# EAGLE design TwoMegCoCo_RAM (EAGLE 7.7.0)
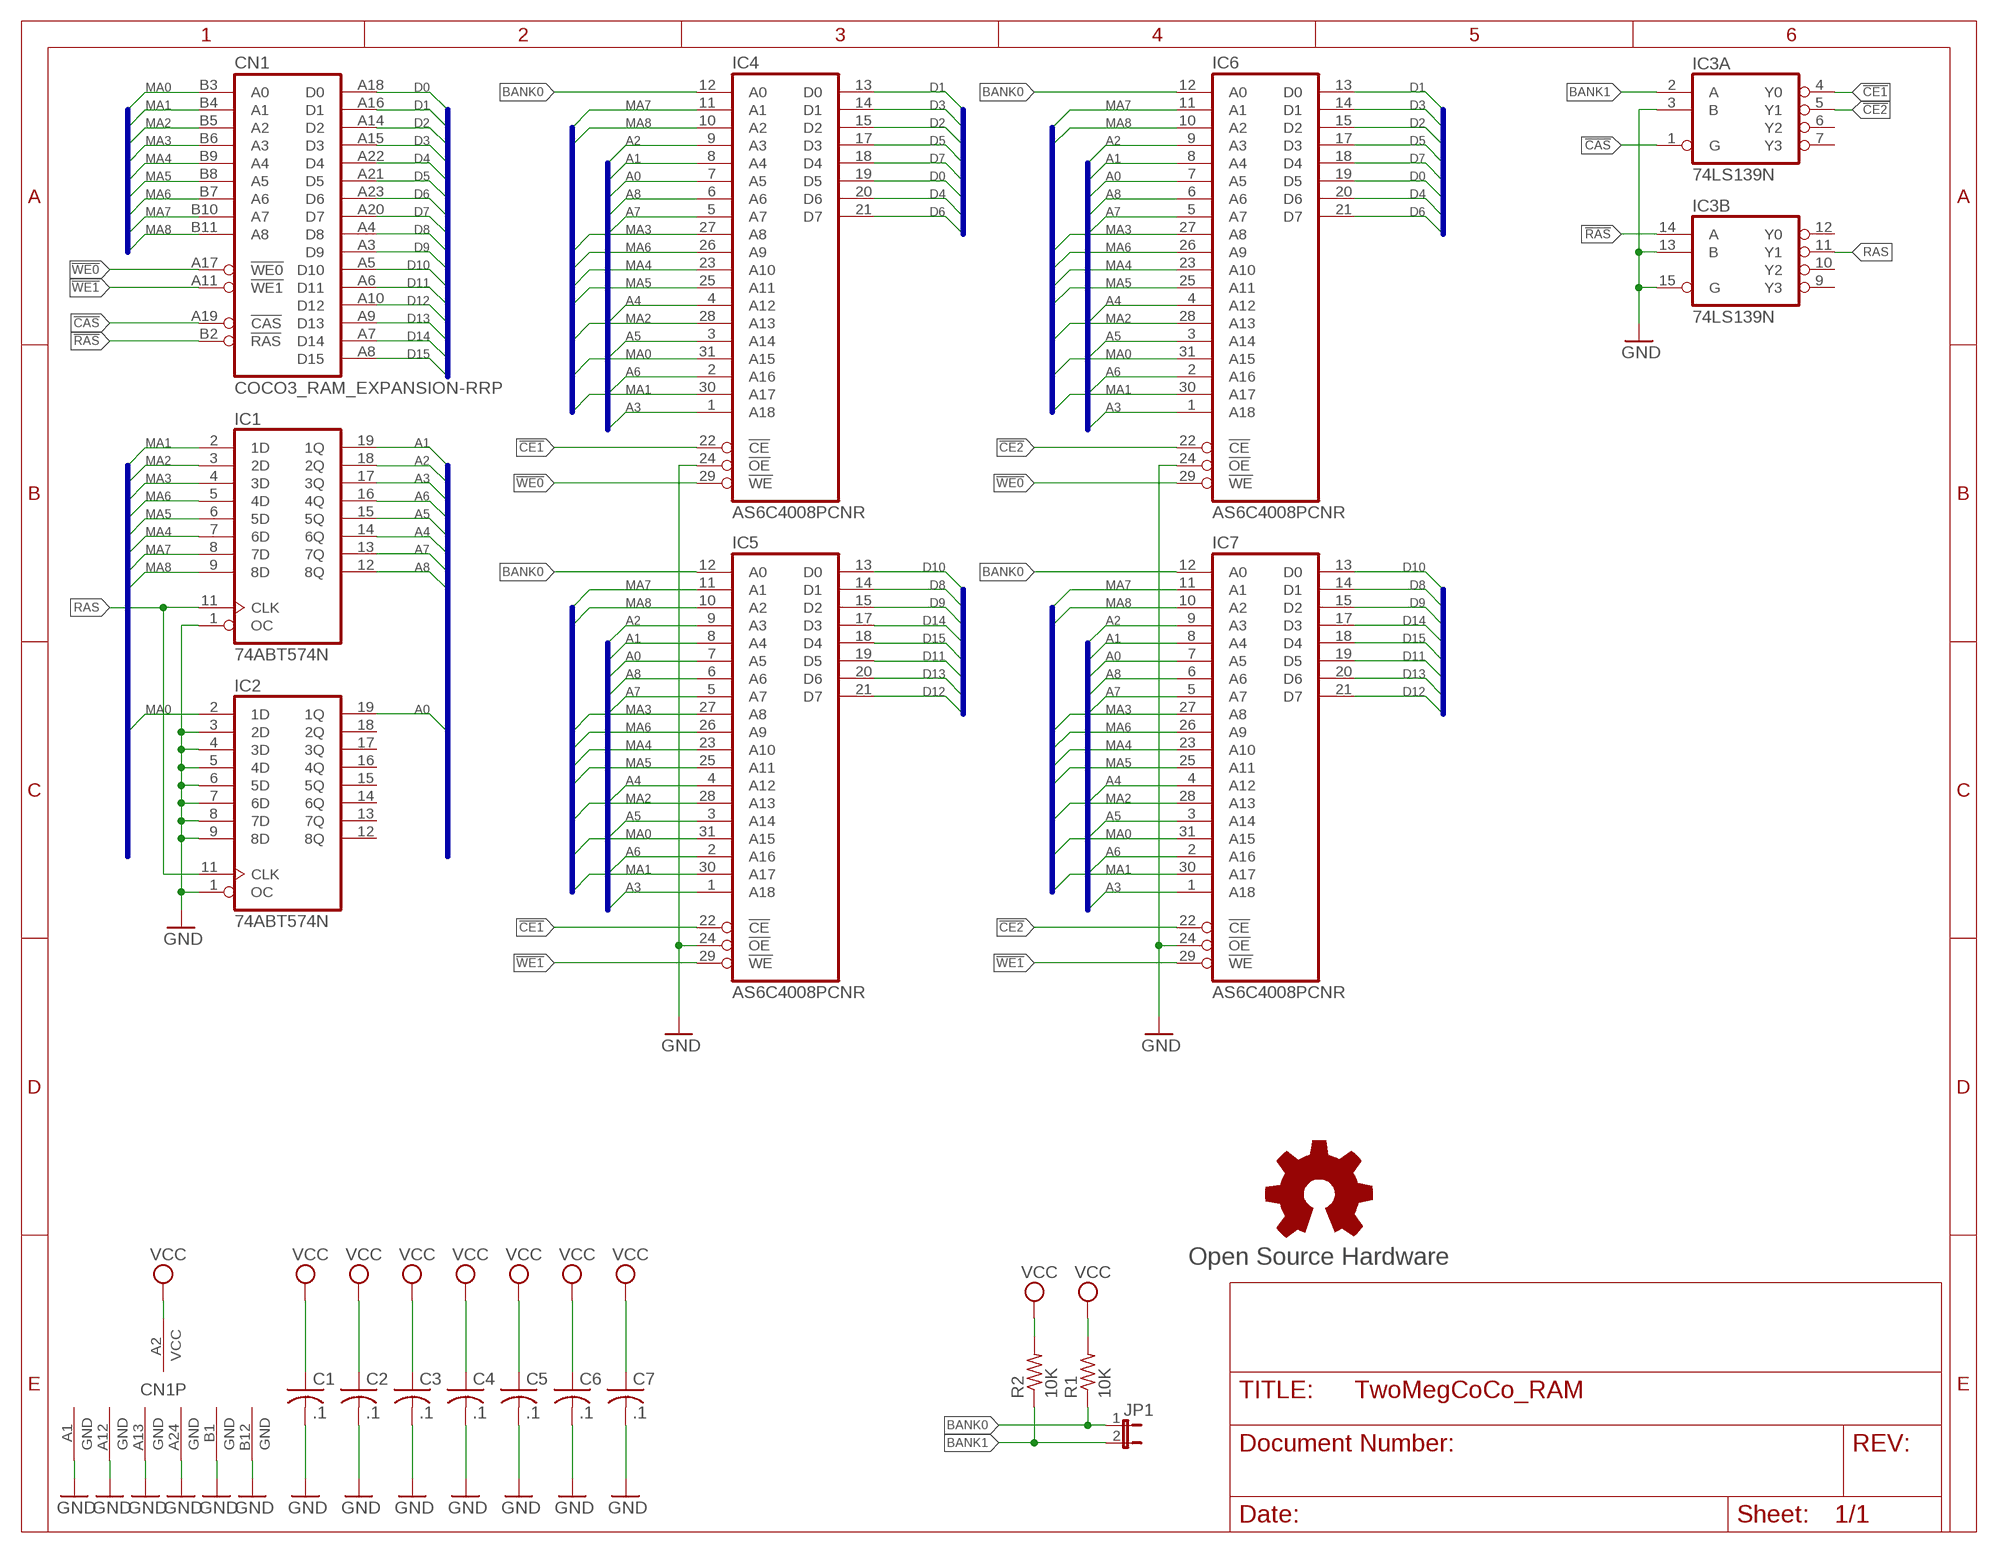
[diagram p0: schematic, sheet 1]

## Parts
C1  .1  C-US025-025X050  [C025-025X050]
C2  .1  C-US025-025X050  [C025-025X050]
C3  .1  C-US025-025X050  [C025-025X050]
C4  .1  C-US025-025X050  [C025-025X050]
C5  .1  C-US025-025X050  [C025-025X050]
C6  .1  C-US025-025X050  [C025-025X050]
C7  .1  C-US025-025X050  [C025-025X050]
CN1  COCO3_RAM_EXPANSION-RRP  [RAM_EXPANSION_REV_RP]
GOLD_ORB_SM1  Open Source Hardware  OSHWLOGOLOGO8MM  [OSHW_8MM]
IC1  74ABT574N  74HC574N  [DIL20-RP]
IC2  74ABT574N  74HC574N  [DIL20-RP]
IC3  74LS139N  [DIL16-RP]
IC4  AS6C4008PCNR  [DIL32-RP]
IC5  AS6C4008PCNR  [DIL32-RP]
IC6  AS6C4008PCNR  [DIL32-RP]
IC7  AS6C4008PCNR  [DIL32-RP]
JP1  JP1E  [JP1]
R1  10K  R-US_0204/7  [0204/7]
R2  10K  R-US_0204/7  [0204/7]

## Nets
!CAS: CN1.A19(!CAS) IC3.1(A:G)
!CE1: IC3.4(A:Y0) IC4.22(!CE) IC5.22(!CE)
!CE2: IC3.5(A:Y1) IC6.22(!CE) IC7.22(!CE)
!RAS: CN1.B2(!RAS) IC3.14(B:A)
!WE0: CN1.A17(!WE0) IC4.29(!WE) IC6.29(!WE)
!WE1: CN1.A11(!WE1) IC5.29(!WE) IC7.29(!WE)
A0: IC2.19(1Q) IC4.7(A5) IC5.7(A5) IC6.7(A5) IC7.7(A5)
A1: IC1.19(1Q) IC4.8(A4) IC5.8(A4) IC6.8(A4) IC7.8(A4)
A2: IC1.18(2Q) IC4.9(A3) IC5.9(A3) IC6.9(A3) IC7.9(A3)
A3: IC1.17(3Q) IC4.1(A18) IC5.1(A18) IC6.1(A18) IC7.1(A18)
A4: IC1.14(6Q) IC4.4(A12) IC5.4(A12) IC6.4(A12) IC7.4(A12)
A5: IC1.15(5Q) IC4.3(A14) IC5.3(A14) IC6.3(A14) IC7.3(A14)
A6: IC1.16(4Q) IC4.2(A16) IC5.2(A16) IC6.2(A16) IC7.2(A16)
A7: IC1.13(7Q) IC4.5(A7) IC5.5(A7) IC6.5(A7) IC7.5(A7)
A8: IC1.12(8Q) IC4.6(A6) IC5.6(A6) IC6.6(A6) IC7.6(A6)
BANK0: IC4.12(A0) IC5.12(A0) IC6.12(A0) IC7.12(A0) JP1.1 R1.1
BANK1: IC3.2(A:A) JP1.2 R2.1
D0: CN1.A18(D0) IC4.19(D5) IC6.19(D5)
D1: CN1.A16(D1) IC4.13(D0) IC6.13(D0)
D2: CN1.A14(D2) IC4.15(D2) IC6.15(D2)
D3: CN1.A15(D3) IC4.14(D1) IC6.14(D1)
D4: CN1.A22(D4) IC4.20(D6) IC6.20(D6)
D5: CN1.A21(D5) IC4.17(D3) IC6.17(D3)
D6: CN1.A23(D6) IC4.21(D7) IC6.21(D7)
D7: CN1.A20(D7) IC4.18(D4) IC6.18(D4)
D8: CN1.A4(D8) IC5.14(D1) IC7.14(D1)
D9: CN1.A3(D9) IC5.15(D2) IC7.15(D2)
D10: CN1.A5(D10) IC5.13(D0) IC7.13(D0)
D11: CN1.A6(D11) IC5.19(D5) IC7.19(D5)
D12: CN1.A10(D12) IC5.21(D7) IC7.21(D7)
D13: CN1.A9(D13) IC5.20(D6) IC7.20(D6)
D14: CN1.A7(D14) IC5.17(D3) IC7.17(D3)
D15: CN1.A8(D15) IC5.18(D4) IC7.18(D4)
GND: C1.2 C2.2 C3.2 C4.2 C5.2 C6.2 C7.2 CN1.A1(GND) CN1.A12(GND) CN1.A13(GND) CN1.A24(GND) CN1.B1(GND) CN1.B12(GND) IC1.1(OC) IC2.1(OC) IC2.3(2D) IC2.4(3D) IC2.5(4D) IC2.6(5D) IC2.7(6D) IC2.8(7D) IC2.9(8D) IC3.3(A:B) IC3.13(B:B) IC3.15(B:G) IC4.24(!OE) IC5.24(!OE) IC6.24(!OE) IC7.24(!OE)
MA0: CN1.B3(A0) IC2.2(1D) IC4.31(A15) IC5.31(A15) IC6.31(A15) IC7.31(A15)
MA1: CN1.B4(A1) IC1.2(1D) IC4.30(A17) IC5.30(A17) IC6.30(A17) IC7.30(A17)
MA2: CN1.B5(A2) IC1.3(2D) IC4.28(A13) IC5.28(A13) IC6.28(A13) IC7.28(A13)
MA3: CN1.B6(A3) IC1.4(3D) IC4.27(A8) IC5.27(A8) IC6.27(A8) IC7.27(A8)
MA4: CN1.B9(A4) IC1.7(6D) IC4.23(A10) IC5.23(A10) IC6.23(A10) IC7.23(A10)
MA5: CN1.B8(A5) IC1.6(5D) IC4.25(A11) IC5.25(A11) IC6.25(A11) IC7.25(A11)
MA6: CN1.B7(A6) IC1.5(4D) IC4.26(A9) IC5.26(A9) IC6.26(A9) IC7.26(A9)
MA7: CN1.B10(A7) IC1.8(7D) IC4.11(A1) IC5.11(A1) IC6.11(A1) IC7.11(A1)
MA8: CN1.B11(A8) IC1.9(8D) IC4.10(A2) IC5.10(A2) IC6.10(A2) IC7.10(A2)
RAS: IC1.11(CLK) IC2.11(CLK) IC3.11(B:Y1)
VCC: C1.1 C2.1 C3.1 C4.1 C5.1 C6.1 C7.1 CN1.A2(VCC) R1.2 R2.2
Unconnected: IC2.12(8Q) IC2.13(7Q) IC2.14(6Q) IC2.15(5Q) IC2.16(4Q) IC2.17(3Q) IC2.18(2Q) IC3.6(A:Y2) IC3.7(A:Y3) IC3.9(B:Y3) IC3.10(B:Y2) IC3.12(B:Y0)

## Buses
D[0..15]
MA[0..8]
A[0..8]

## Power pins joined to a net without a drawn wire
GND: IC1.10(GND) IC2.10(GND) IC3.8(P:GND) IC4.16(GND) IC5.16(GND) IC6.16(GND) IC7.16(GND)
VCC: IC1.20(VCC) IC2.20(VCC) IC3.16(P:VCC) IC4.32(VCC) IC5.32(VCC) IC6.32(VCC) IC7.32(VCC)

## Library data of the parts
C1-C7 = rcl:C-US: CAPACITOR, American symbol
CN1 = coco:COCO3_RAM_EXPANSION
GOLD_ORB_SM1 = oshw:OSHWLOGO: The OSHW logo for PCB layout
IC1 IC2 = 74xx-us-jlb:74*574: 8-bit D type FLIP FLOP bus driver
IC3 = 74xx-us-jlb:74*139: Dual 2-line to 4-line DECODER/DEMULTIPLEXER
IC4-IC7 = memory-alliance:AS6C4008
JP1 = jumper-jlb:JP1E: JUMPER
R1 R2 = resistor:R-US_: RESISTOR, American symbol

## Board
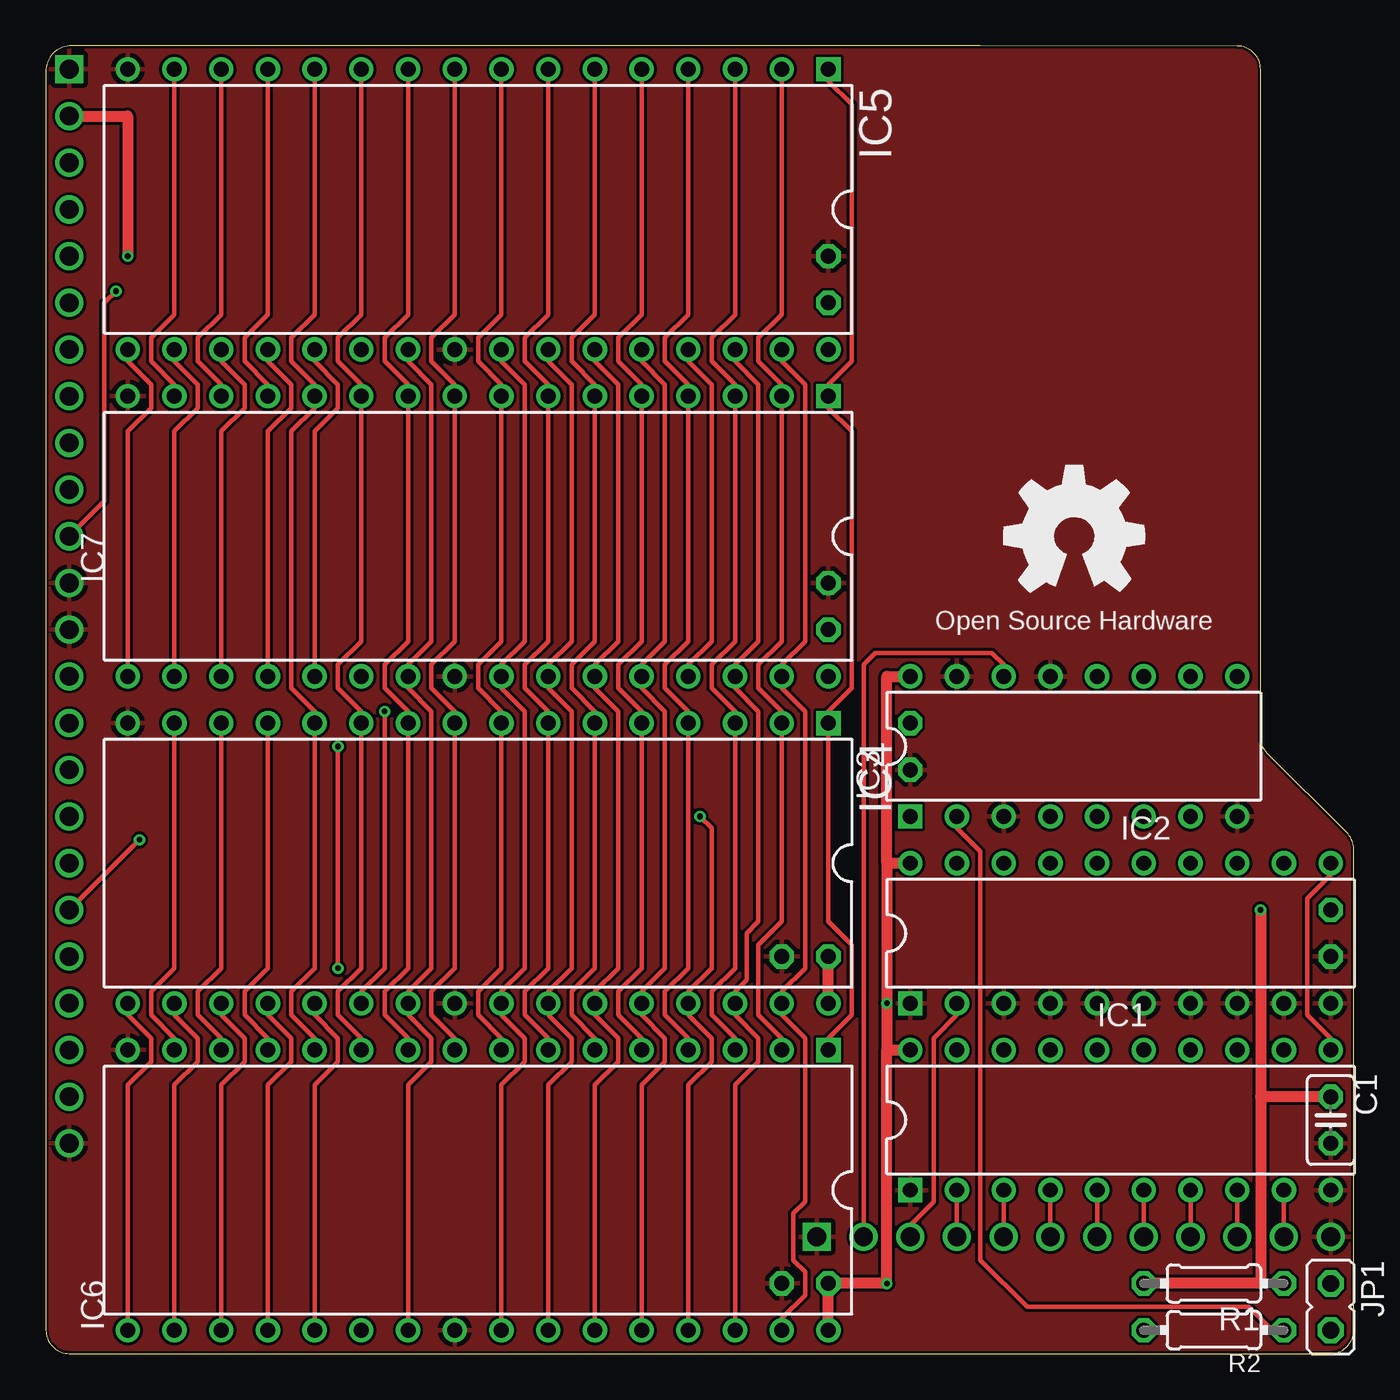
[diagram p1: board, top side]
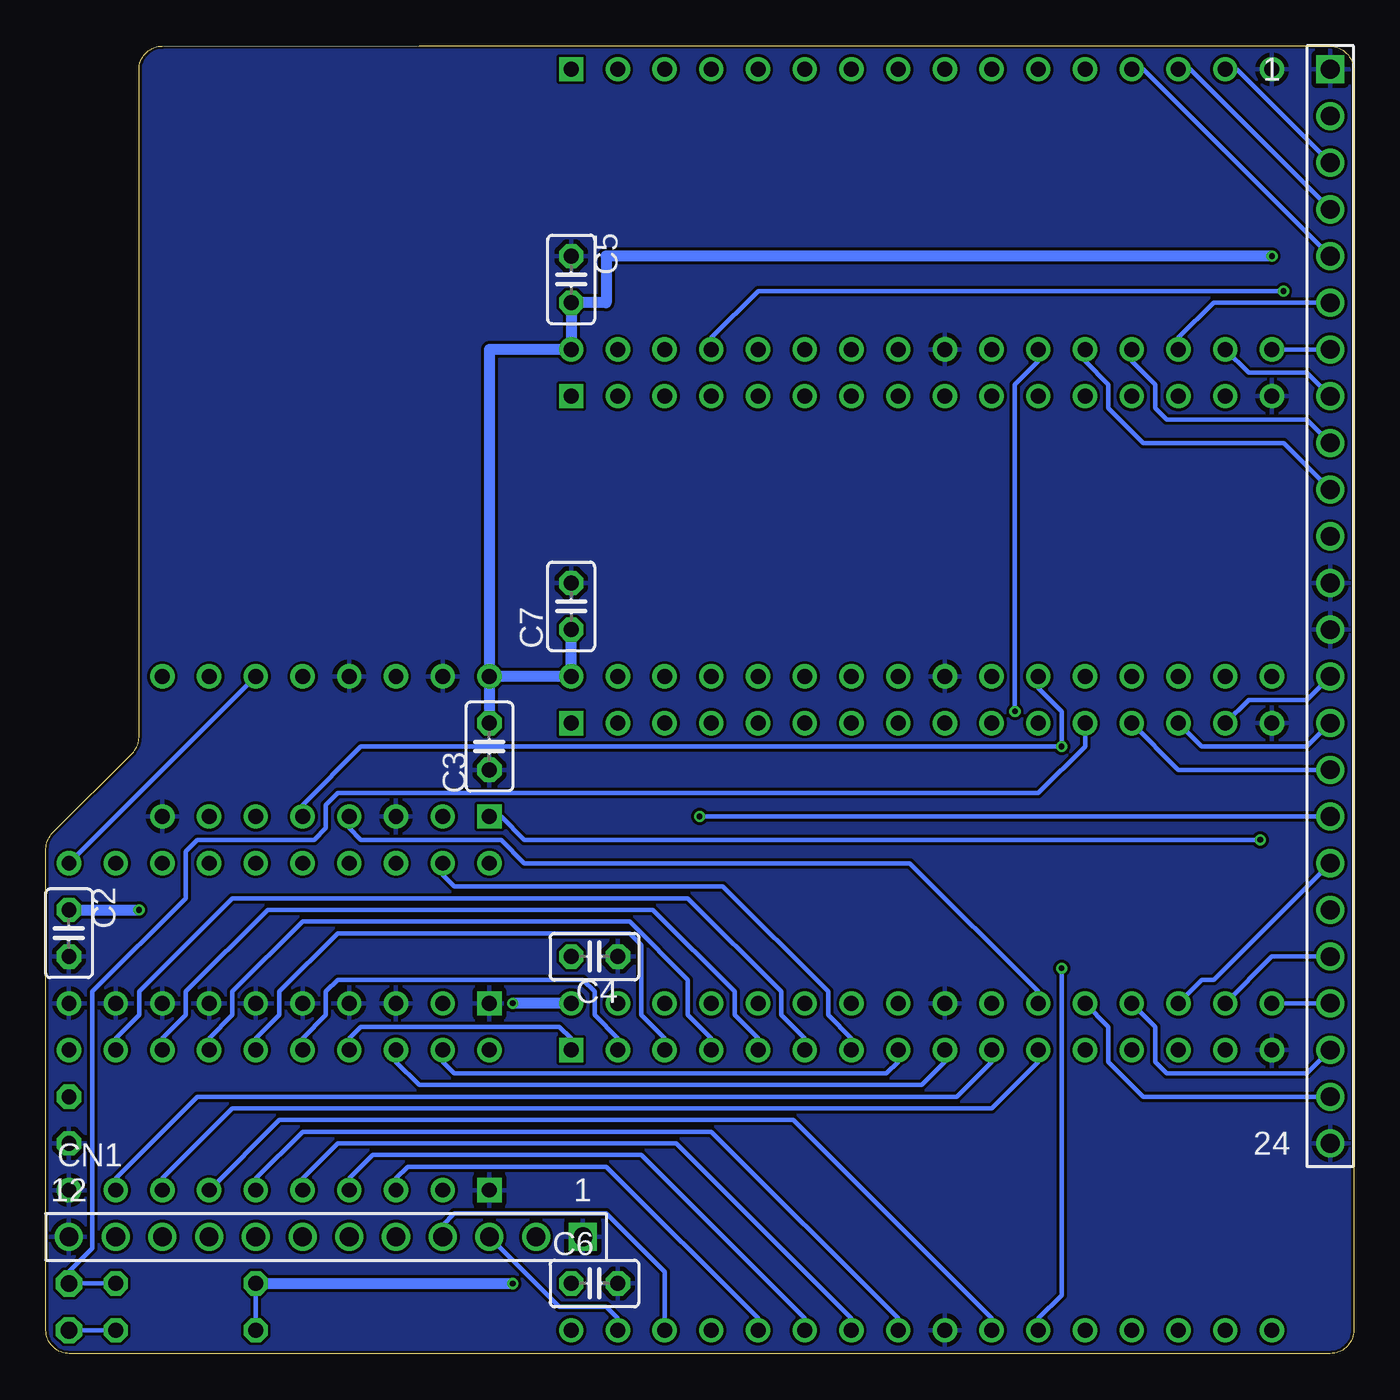
[diagram p2: board, bottom side, seen from below]

Size 71.1 x 71.12 mm. Coordinates in mm from the lower left corner, seen from the top.
Outline: 64.77,71.12 50.79,71.12 1.27,71.12 arc85 0,69.85 0,1.27 arc90 1.27,0 69.83,0 arc90 71.1,1.27 71.1,27.43 arc45 70.73,28.33 66.41,32.65 arc-49 66.04,33.64 66.04,69.84 arc90 64.77,71.12
Copper layers (1*16): Top 0.035mm / dielectric 1.5mm / Bottom 0.035mm
Design rules "hackvana *": minimum track width 6mil, minimum drill 0.3mm, track to track 6mil, track to pad 6mil, pad to pad 6mil, via to via 6mil, smd to smd 0mil, copper to edge 6mil, drill to drill 6mil, minimum pad ring 10mil, minimum via ring 6mil, stop-mask expansion 2mil, vias tented up to drill 100mil, thermal gap 10mil

### Footprints (pad centres in the part's own frame; a part is rotated, then mirrored left to right if it is on the bottom)
C025-025X050 = drill 0.813 octagon: 1 -1.27,0; 2 1.27,0
RAM_EXPANSION_REV_RP = drill 1.016 square: A1 -34.29,31.75; B1 6.35,-31.75 | drill 1.016: A2 -34.29,29.21; A3 -34.29,26.67; A4 -34.29,24.13; A5 -34.29,21.59; A6 -34.29,19.05; A7 -34.29,16.51; A8 -34.29,13.97; A9 -34.29,11.43; A10 -34.29,8.89; A11 -34.29,6.35; A12 -34.29,3.81; A13 -34.29,1.27; A14 -34.29,-1.27; A15 -34.29,-3.81; A16 -34.29,-6.35; A17 -34.29,-8.89; A18 -34.29,-11.43; A19 -34.29,-13.97; A20 -34.29,-16.51; A21 -34.29,-19.05; A22 -34.29,-21.59; A23 -34.29,-24.13; A24 -34.29,-26.67; B2 8.89,-31.75; B3 11.43,-31.75; B4 13.97,-31.75; B5 16.51,-31.75; B6 19.05,-31.75; B7 21.59,-31.75; B8 24.13,-31.75; B9 26.67,-31.75; B10 29.21,-31.75; B11 31.75,-31.75; B12 34.29,-31.75
DIL20-RP = drill 0.813 square: 1 -11.43,-3.81 | drill 0.813: 2 -8.89,-3.81; 3 -6.35,-3.81; 4 -3.81,-3.81; 5 -1.27,-3.81; 6 1.27,-3.81; 7 3.81,-3.81; 8 6.35,-3.81; 9 8.89,-3.81; 10 11.43,-3.81; 11 11.43,3.81; 12 8.89,3.81; 13 6.35,3.81; 14 3.81,3.81; 15 1.27,3.81; 16 -1.27,3.81; 17 -3.81,3.81; 18 -6.35,3.81; 19 -8.89,3.81; 20 -11.43,3.81
DIL16-RP = drill 0.813 square: 1 -8.89,-3.81 | drill 0.813: 2 -6.35,-3.81; 3 -3.81,-3.81; 4 -1.27,-3.81; 5 1.27,-3.81; 6 3.81,-3.81; 7 6.35,-3.81; 8 8.89,-3.81; 9 8.89,3.81; 10 6.35,3.81; 11 3.81,3.81; 12 1.27,3.81; 13 -1.27,3.81; 14 -3.81,3.81; 15 -6.35,3.81; 16 -8.89,3.81
DIL32-RP = drill 0.813 square: 1 -19.05,-7.62 | drill 0.813: 2 -16.51,-7.62; 3 -13.97,-7.62; 4 -11.43,-7.62; 5 -8.89,-7.62; 6 -6.35,-7.62; 7 -3.81,-7.62; 8 -1.27,-7.62; 9 1.27,-7.62; 10 3.81,-7.62; 11 6.35,-7.62; 12 8.89,-7.62; 13 11.43,-7.62; 14 13.97,-7.62; 15 16.51,-7.62; 16 19.05,-7.62; 17 19.05,7.62; 18 16.51,7.62; 19 13.97,7.62; 20 11.43,7.62; 21 8.89,7.62; 22 6.35,7.62; 23 3.81,7.62; 24 1.27,7.62; 25 -1.27,7.62; 26 -3.81,7.62; 27 -6.35,7.62; 28 -8.89,7.62; 29 -11.43,7.62; 30 -13.97,7.62; 31 -16.51,7.62; 32 -19.05,7.62
JP1 = drill 0.914 octagon: 1 0,-1.27; 2 0,1.27
0204/7 = drill 0.813 octagon: 1 -3.81,0; 2 3.81,0

### Placement (x,y rotation side)
C1  69.85,12.7 270 top
C2  69.85,22.86 270 bottom
C3  46.99,33.02 270 bottom
C4  41.27,21.59 0 bottom
C5  42.54,58.42 90 bottom
C6  41.27,3.81 0 bottom
C7  42.54,40.64 90 bottom
CN1  35.56,38.1 0 top
GOLD_ORB_SM1  55.88,44.45 0 top
IC1  58.42,12.7 0 top
IC2  58.42,22.86 0 top
IC3  55.88,33.02 0 top
IC4  23.5,26.67 180 top
IC5  23.5,62.23 180 top
IC6  23.5,8.89 180 top
IC7  23.5,44.45 180 top
JP1  69.85,2.54 180 top
R1  63.5,3.81 180 top
R2  63.5,1.27 180 top

### Tracks (layer width: path | path; a pad name or v marks a point on that pad's centre or on a via)
!CAS  (via drill 0.3)
  Top 0.254: CN1.A19 v5.08,27.94
  Bottom 0.254: v5.08,27.94 45.08,27.94 46.35,29.21 IC3.1
!CE1  (via drill 0.3)
  Top 0.254: v18.41,34.92 18.41,20.95 17.14,19.68 IC4.22
  Bottom 0.254: IC5.22 17.14,53.98 18.41,52.71 v18.41,34.92 | IC3.4 54.61,28.57 53.97,27.94 46.35,27.94 45.08,26.67 24.13,26.67 17.14,19.68 IC4.22
!CE2  (via drill 0.3)
  Top 0.254: v15.88,20.95 v15.88,33.02
  Bottom 0.254: IC6.22 17.14,1.91 15.88,3.17 v15.88,20.95 | IC7.22 17.14,36.2 15.88,34.92 v15.88,33.02 53.97,33.02 57.15,29.84 IC3.5
!RAS
  Top 0.254: IC3.14 52.07,37.47 51.43,38.1 45.08,38.1 44.45,37.47 CN1.B2
!WE0  (via drill 0.3)
  Top 0.254: IC6.29 34.92,14.61 36.2,15.88 36.2,17.14 34.92,18.41 IC4.29 34.92,19.68 36.2,20.95 36.2,28.57 v35.56,29.21
  Bottom 0.254: CN1.A17 34.29,29.21 v35.56,29.21
!WE1  (via drill 0.3)
  Top 0.254: IC5.29 34.92,53.98 36.2,52.71 36.2,38.73 34.92,37.47 IC7.29 | CN1.A11 3.18,46.36 3.18,57.15 v3.81,57.79
  Bottom 0.254: v3.81,57.79 32.38,57.79 34.92,55.25 IC5.29
A0
  Top 0.254: IC5.7 27.3,56.52 26.04,55.25 26.04,53.98 27.3,52.71 IC7.7 27.3,38.73 26.04,37.47 26.04,36.2 27.3,34.92 IC4.7 27.3,20.95 26.04,19.68 26.04,18.41 27.3,17.14 IC6.7
  Bottom 0.254: IC2.19 49.53,26.04 48.89,25.4 34.29,25.4 28.57,19.68 28.57,18.41 27.3,17.14 IC6.7
A1
  Top 0.254: IC5.8 24.77,56.52 23.5,55.25 23.5,53.98 24.77,52.71 IC7.8 24.77,38.73 23.5,37.47 23.5,36.2 24.77,34.92 IC4.8 24.77,20.95 23.5,19.68 23.5,18.41 24.77,17.14 IC6.8
  Bottom 0.254: IC1.19 49.53,15.88 48.89,15.24 25.4,15.24 24.77,15.88 IC6.8
A2
  Top 0.254: IC5.9 22.23,56.52 20.96,55.25 20.96,53.98 22.23,52.71 IC7.9 22.23,38.73 20.96,37.47 20.96,36.2 22.23,34.92 IC4.9 22.23,20.95 20.96,19.68 20.96,18.41 22.23,17.14 IC6.9
  Bottom 0.254: IC1.18 52.07,15.88 50.8,14.61 23.5,14.61 22.23,15.88 IC6.9
A3
  Top 0.254: IC5.1 42.54,69.22 43.81,67.95 43.81,53.98 42.54,52.71 IC7.1 42.54,51.44 43.81,50.16 43.81,36.2 42.54,34.92 IC4.1 42.54,23.49 43.81,22.22 43.81,18.41 42.54,17.14 IC6.1
  Bottom 0.254: IC1.17 54.61,17.14 53.97,17.78 43.18,17.78 42.54,17.14 IC6.1
A4
  Top 0.254: IC5.4 34.92,56.52 33.65,55.25 33.65,53.98 34.92,52.71 IC7.4 34.92,38.73 33.65,37.47 33.65,36.2 34.92,34.92 IC4.4 34.92,20.95 33.65,19.68 33.65,18.41 34.92,17.14 IC6.4
  Bottom 0.254: IC1.14 62.23,17.14 60.96,18.41 60.96,19.68 57.15,23.49 39.37,23.49 36.2,20.32 36.2,18.41 34.92,17.14 IC6.4
A5
  Top 0.254: IC5.3 37.46,56.52 36.2,55.25 36.2,53.98 37.46,52.71 IC7.3 37.46,38.73 36.2,37.47 36.2,36.2 37.46,34.92 IC4.3 37.46,20.95 36.2,19.68 36.2,18.41 37.46,17.14 IC6.3
  Bottom 0.254: IC1.15 59.69,17.14 58.42,18.41 58.42,19.68 55.24,22.86 39.37,22.86 38.73,22.22 38.73,18.41 37.46,17.14 IC6.3
A6
  Top 0.254: IC5.2 40,56.52 38.73,55.25 38.73,53.98 40,52.71 IC7.2 40,38.73 38.73,37.47 38.73,36.2 40,34.92 IC4.2 40,23.49 38.73,22.22 38.73,18.41 40,17.14 IC6.2
  Bottom 0.254: IC1.16 57.15,17.14 55.88,18.41 55.88,19.68 55.24,20.32 41.91,20.32 41.27,19.68 41.27,18.41 40,17.14 IC6.2
A7
  Top 0.254: IC5.5 32.38,56.52 31.11,55.25 31.11,53.98 32.38,52.71 IC7.5 32.38,38.73 31.11,37.47 31.11,36.2 32.38,34.92 IC4.5 32.38,20.95 31.11,19.68 31.11,18.41 32.38,17.14 IC6.5
  Bottom 0.254: IC1.13 64.77,17.14 63.5,18.41 63.5,19.68 59.05,24.13 38.1,24.13 33.65,19.68 33.65,18.41 32.38,17.14 IC6.5
A8
  Top 0.254: IC5.6 29.84,56.52 28.57,55.25 28.57,53.98 29.84,52.71 IC7.6 29.84,38.73 28.57,37.47 28.57,36.2 29.84,34.92 IC4.6 29.84,20.95 28.57,19.68 28.57,18.41 29.84,17.14 IC6.6
  Bottom 0.254: IC1.12 67.31,17.14 66.04,18.41 66.04,19.68 60.96,24.76 36.2,24.76 31.11,19.68 31.11,18.41 29.84,17.14 IC6.6
BANK0
  Top 0.254: IC5.12 14.61,56.52 13.34,55.25 13.34,53.98 14.61,52.71 IC7.12 14.61,51.44 13.34,50.16 13.34,36.2 14.61,34.92 IC4.12 14.61,20.95 13.34,19.68 13.34,18.41 14.61,17.14 IC6.12
  Bottom 0.254: IC4.12 14.61,33.02 17.14,30.48 55.24,30.48 55.88,29.84 55.88,28.57 56.51,27.94 62.87,27.94 63.5,27.3 63.5,24.76 68.58,19.68 68.58,5.71 69.85,4.45 JP1.1 R1.1
BANK1
  Top 0.254: IC3.2 49.53,28.57 50.8,27.3 50.8,5.08 53.34,2.54 65.41,2.54 66.67,1.27 R2.1
  Bottom 0.254: R2.1 JP1.2
D0
  Top 0.254: IC4.19 9.53,18.41 10.79,17.14 10.79,15.88 9.53,14.61 IC6.19
  Bottom 0.254: CN1.A18 7.62,20.32 8.26,20.32 IC4.19
D1
  Top 0.254: IC6.13 12.07,17.14 10.79,18.41 10.79,19.68 12.07,20.95 IC4.13
  Bottom 0.254: CN1.A16 9.53,31.75 IC4.13
D2
  Top 0.254: IC4.15 6.99,20.95 5.71,19.68 5.71,18.41 6.99,17.14 IC6.15
  Bottom 0.254: CN1.A14 2.54,35.56 5.71,35.56 IC4.15
D3
  Top 0.254: IC6.14 9.53,17.14 8.26,18.41 8.26,19.68 9.53,20.95 IC4.14
  Bottom 0.254: CN1.A15 2.54,33.02 8.26,33.02 IC4.14
D4
  Top 0.254: IC6.20 12.07,14.61 13.34,15.88 13.34,17.14 12.07,18.41 IC4.20
  Bottom 0.254: CN1.A22 2.54,15.24 10.16,15.24 10.79,15.88 10.79,17.78 IC4.20
D5
  Top 0.254: IC4.17 4.45,18.41 5.71,17.14 5.71,15.88 4.45,14.61 IC6.17
  Bottom 0.254: CN1.A21 IC4.17
D6
  Top 0.254: IC6.21 14.61,14.61 15.88,15.88 15.88,17.14 14.61,18.41 IC4.21
  Bottom 0.254: CN1.A23 11.43,13.97 13.34,15.88 13.34,17.78 IC4.21
D7
  Top 0.254: IC4.18 6.99,18.41 8.26,17.14 8.26,15.88 6.99,14.61 IC6.18
  Bottom 0.254: CN1.A20 4.45,21.59 IC4.18
D8
  Top 0.254: IC7.14 9.53,52.71 8.26,53.98 8.26,55.25 9.53,56.52 IC5.14
  Bottom 0.254: CN1.A4 8.89,69.85 IC5.14
D9
  Top 0.254: IC7.15 6.99,52.71 5.71,53.98 5.71,55.25 6.99,56.52 IC5.15
  Bottom 0.254: CN1.A3 6.35,69.85 IC5.15
D10
  Top 0.254: IC7.13 12.07,52.71 10.79,53.98 10.79,55.25 12.07,56.52 IC5.13
  Bottom 0.254: CN1.A5 11.43,69.85 IC5.13
D11
  Top 0.254: IC7.19 9.53,50.16 10.79,51.44 10.79,52.71 9.53,53.98 IC5.19
  Bottom 0.254: CN1.A6 7.62,57.15 9.53,55.25 IC5.19
D12
  Top 0.254: IC7.21 14.61,50.16 15.88,51.44 15.88,52.71 14.61,53.98 IC5.21
  Bottom 0.254: CN1.A10 3.81,49.53 11.43,49.53 13.34,51.44 13.34,52.71 14.61,53.98 IC5.21
D13
  Top 0.254: IC7.20 12.07,50.16 13.34,51.44 13.34,52.71 12.07,53.98 IC5.20
  Bottom 0.254: CN1.A9 2.54,50.8 10.16,50.8 10.79,51.44 10.79,52.71 12.07,53.98 IC5.20
D14
  Top 0.254: IC5.17 4.45,53.98 5.71,52.71 5.71,51.44 4.45,50.16 IC7.17
  Bottom 0.254: CN1.A7 IC5.17
D15
  Top 0.254: IC7.18 6.99,50.16 8.26,51.44 8.26,52.71 6.99,53.98 IC5.18
  Bottom 0.254: CN1.A8 2.54,53.34 5.71,53.34 IC5.18
GND
  pour Bottom: 0,1.27 0,69.85 arc-90 1.27,71.12 64.77,71.12 arc-90 66.04,69.85 66.04,33.55 arc45 66.41,32.65 70.75,28.31 arc-45 71.12,27.41 71.12,1.27 arc-90 69.85,0 1.27,0 arc-90
  pour Top: 0,1.27 0,69.85 arc-90 1.27,71.12 64.77,71.12 arc-90 66.04,69.85 66.04,33.55 arc45 66.41,32.65 70.75,28.31 arc-45 71.12,27.41 71.12,1.27 arc-90 69.85,0 1.27,0 arc-90
MA0
  Top 0.254: IC2.2 49.53,18.41 48.26,17.14 48.26,8.26 46.99,6.98 CN1.B3 | IC5.31 40,53.98 41.27,52.71 41.27,38.73 40,37.47 IC7.31 40,36.2 41.27,34.92 41.27,20.95 40,19.68 IC4.31 40,18.41 41.27,17.14 41.27,8.26 40.64,7.62 40.64,5.08 41.27,4.45 41.27,3.17 40,1.91 IC6.31
  Bottom 0.254: CN1.B3 43.18,2.54 40.64,2.54 40,1.91 IC6.31
MA1
  Top 0.254: IC1.2 CN1.B4 | IC5.30 37.46,53.98 38.73,52.71 38.73,38.73 37.46,37.47 IC7.30 37.46,36.2 38.73,34.92 38.73,23.49 38.1,22.86 38.1,20.32 37.46,19.68 IC4.30 37.46,18.41 38.73,17.14 38.73,15.88 37.46,14.61 IC6.30
  Bottom 0.254: CN1.B4 49.53,6.98 48.89,7.62 40.64,7.62 37.46,4.45 IC6.30
MA2
  Top 0.254: IC1.3 CN1.B5 | IC5.28 32.38,53.98 33.65,52.71 33.65,38.73 32.38,37.47 IC7.28 32.38,36.2 33.65,34.92 33.65,20.95 32.38,19.68 IC4.28 32.38,18.41 33.65,17.14 33.65,15.88 32.38,14.61 IC6.28
  Bottom 0.254: IC1.3 52.07,9.53 51.43,10.16 40.64,10.16 32.38,1.91 IC6.28
MA3
  Top 0.254: CN1.B6 IC1.4 | IC5.27 29.84,53.98 31.11,52.71 31.11,38.73 29.84,37.47 IC7.27 29.84,36.2 31.11,34.92 31.11,20.95 29.84,19.68 IC4.27 29.84,18.41 31.11,17.14 31.11,15.88 29.84,14.61 IC6.27
  Bottom 0.254: IC1.4 54.61,9.53 53.34,10.79 38.73,10.79 29.84,1.91 IC6.27
MA4
  Top 0.254: CN1.B9 IC1.7 | IC5.23 19.68,53.98 20.96,52.71 20.96,38.73 19.68,37.47 IC7.23 19.68,36.2 20.96,34.92 20.96,20.95 19.68,19.68 IC4.23 19.68,18.41 20.96,17.14 20.96,15.88 19.68,14.61 IC6.23
  Bottom 0.254: IC1.7 58.42,12.7 30.48,12.7 19.68,1.91 IC6.23
MA5
  Top 0.254: CN1.B8 IC1.6 | IC5.25 24.77,53.98 26.04,52.71 26.04,38.73 24.77,37.47 IC7.25 24.77,36.2 26.04,34.92 26.04,20.95 24.77,19.68 IC4.25 24.77,18.41 26.04,17.14 26.04,15.88 24.77,14.61 IC6.25
  Bottom 0.254: IC1.6 59.69,9.53 57.15,12.07 34.92,12.07 24.77,1.91 IC6.25
MA6
  Top 0.254: CN1.B7 IC1.5 | IC5.26 27.3,53.98 28.57,52.71 28.57,38.73 27.3,37.47 IC7.26 27.3,36.2 28.57,34.92 28.57,20.95 27.3,19.68 IC4.26 27.3,18.41 28.57,17.14 28.57,15.88 27.3,14.61 IC6.26
  Bottom 0.254: IC1.5 57.15,9.53 55.24,11.43 36.83,11.43 27.3,1.91 IC6.26
MA7
  Top 0.254: CN1.B10 IC1.8 | IC5.11 17.14,56.52 15.88,55.25 15.88,53.98 17.14,52.71 IC7.11 17.14,38.73 15.88,37.47 15.88,36.2 17.14,34.92 IC4.11 17.14,20.95 15.88,19.68 15.88,18.41 17.14,17.14 IC6.11
  Bottom 0.254: IC1.8 64.77,9.53 60.96,13.34 19.68,13.34 17.14,15.88 IC6.11
MA8
  Top 0.254: CN1.B11 IC1.9 | IC5.10 19.68,56.52 18.41,55.25 18.41,53.98 19.68,52.71 IC7.10 19.68,38.73 18.41,37.47 18.41,36.2 19.68,34.92 IC4.10 19.68,20.95 18.41,19.68 18.41,18.41 19.68,17.14 IC6.10
  Bottom 0.254: IC1.9 67.31,9.53 62.87,13.97 21.59,13.97 19.68,15.88 IC6.10
RAS
  Top 0.254: IC1.11 69.85,17.14 68.58,18.41 68.58,24.76 69.85,26.04 IC2.11
  Bottom 0.254: IC3.11 IC2.11
VCC  (via drill 0.3)
  Top 0.61: CN1.A2 4.45,67.31 v4.45,59.69 | IC2.20 45.72,26.67 | 45.72,26.67 45.72,36.83 IC3.16 | 45.72,26.67 v45.72,19.05 45.72,16.51 | IC4.32 C4.1 | 45.72,16.51 IC1.20 | IC6.32 C6.1 v45.72,3.81 45.72,16.51 | C1.1 66.04,13.97 | 66.04,13.97 66.04,3.81 R1.2 | v66.04,24.13 66.04,13.97
  Bottom 0.254: R2.2 R1.2
  Bottom 0.61: v4.45,59.69 40.64,59.69 40.64,57.15 C5.1 IC5.32 46.99,54.61 IC3.16 | IC3.16 IC7.32 C7.1 | IC3.16 C3.1 | IC4.32 v45.72,19.05 | R1.2 v45.72,3.81 | C2.1 v66.04,24.13